# Altium schematic sheet Sheet1.SchDoc
size A4
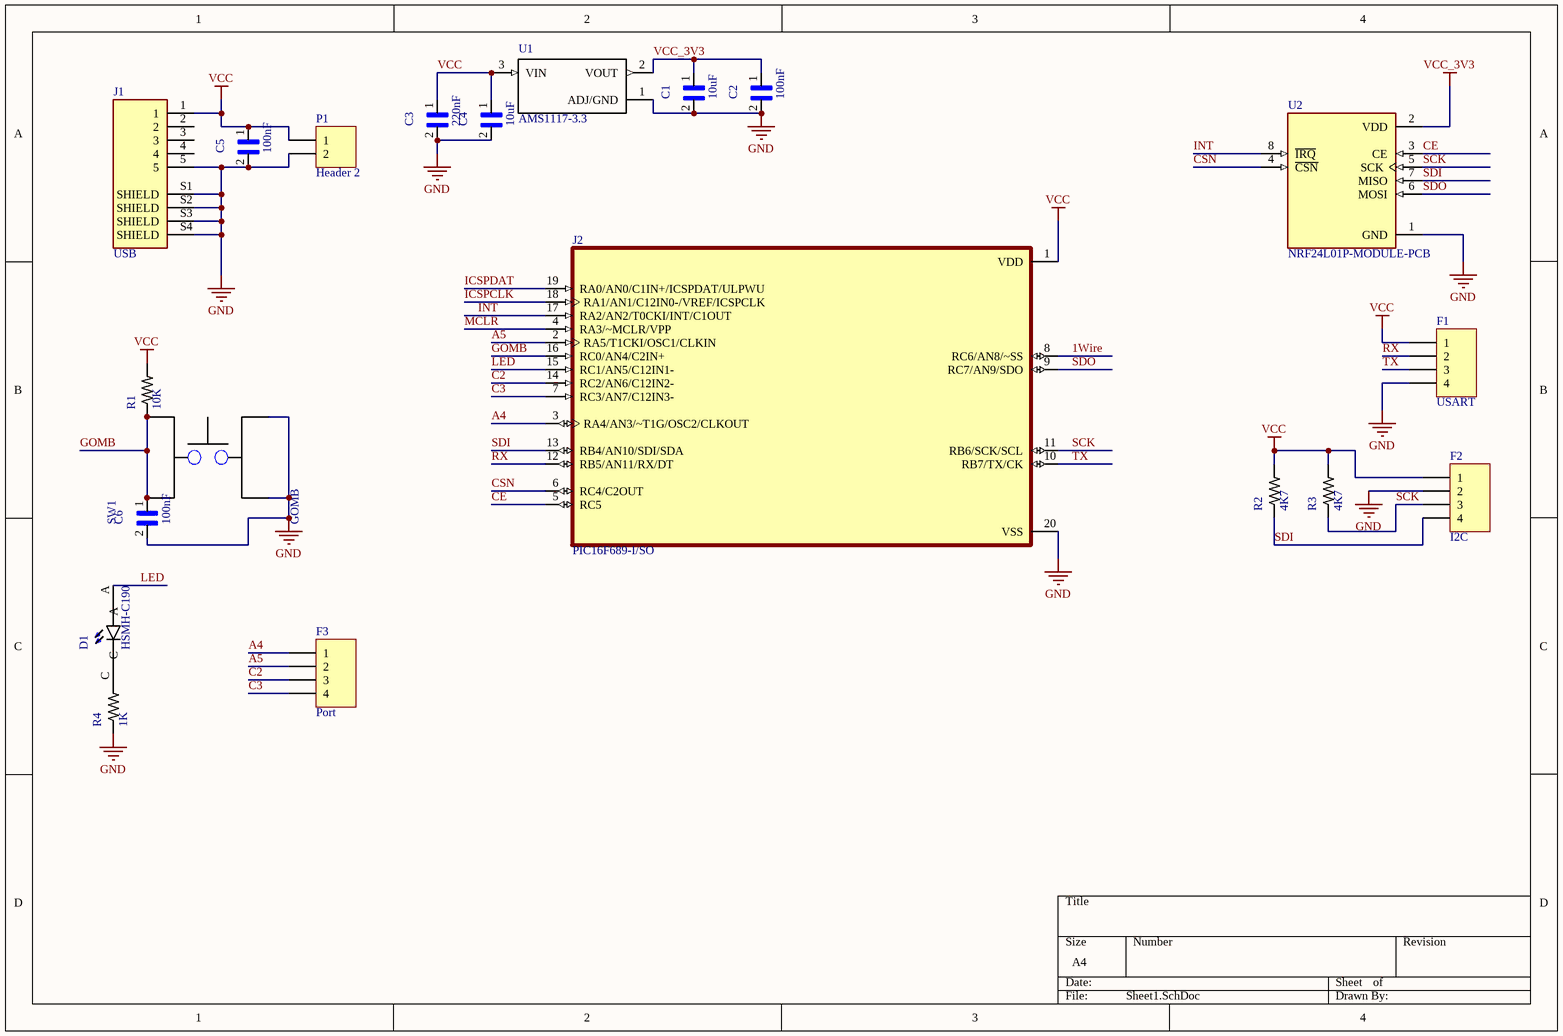
[diagram p0: Sheet1.SchDoc]

## Parts
C1  10uF  [CAP0603]
C2  100nF  [CAP0603]
C3  220nF  [CAP0603]
C4  10uF  [CAP0603]
C5  100nF  [CAP0603]
C6  100nF  [CAP0603]
D1  HSMH-C190  [LEDM1608X80_HSMH-C190(Primary)]
F1  USART  [HDR1X4]
F2  I2C  [HDR1X4]
F3  Port  [HDR1X4]
J1  USB  [WE_629105136821]
J2  PIC16F689-I/SO  [SOIC127P1032X265-20N]
P1  Header 2  [HDR1X2]
R1  10K  [RES0603]
R2  4K7  [RES0603]
R3  4K7  [RES0603]
R4  1K  [RES0603]
SW1  GOMB  [SW_TL3342F160QG/TR]
U1  AMS1117-3.3  [SOT229P700X180-4N]
U2  NRF24L01P-MODULE-PCB  [XCVR_NRF24L01P-MODULE-PCB]

## Nets
GND: C1.2 C2.2 C3.2 C4.2 C5.2 C6.2 F1.4 F2.2 J1.5 J1.S1(SHIELD) J1.S2(SHIELD) J1.S3(SHIELD) J1.S4(SHIELD) J2.20(VSS) P1.2 R4.1 SW1.1 SW1.2 U1.1(ADJ/GND) U2.1(GND)
VCC: C3.1 C4.1 C5.1 F1.1 F2.1 J1.1 J2.1(VDD) P1.1 R1.2 R2.2 R3.2 U1.3(VIN)
VCC_3V3: C1.1 C2.1 U1.2(VOUT) U2.2(VDD)
1Wire: J2.8(RC6/AN8/~SS)
A4: F3.1 J2.3(RA4/AN3/~T1G/OSC2/CLKOUT)
A5: F3.2 J2.2(RA5/T1CKI/OSC1/CLKIN)
C2: F3.3 J2.14(RC2/AN6/C12IN2-)
C3: F3.4 J2.7(RC3/AN7/C12IN3-)
CE: J2.5(RC5) U2.3(CE)
CSN: J2.6(RC4/C2OUT) U2.4(~{CSN})
GOMB: C6.1 J2.16(RC0/AN4/C2IN+) R1.1 SW1.3 SW1.4
ICSPCLK: J2.18(RA1/AN1/C12IN0-/VREF/ICSPCLK)
ICSPDAT: J2.19(RA0/AN0/C1IN+/ICSPDAT/ULPWU)
INT: J2.17(RA2/AN2/T0CKI/INT/C1OUT) U2.8(~{IRQ})
LED: D1.A J2.15(RC1/AN5/C12IN1-)
MCLR: J2.4(RA3/~MCLR/VPP)
RX: F1.2 J2.12(RB5/AN11/RX/DT)
SCK: F2.3 J2.11(RB6/SCK/SCL) R3.1 U2.5(SCK)
SDI: F2.4 J2.13(RB4/AN10/SDI/SDA) R2.1 U2.7(MISO)
SDO: J2.9(RC7/AN9/SDO) U2.6(MOSI)
TX: F1.3 J2.10(RB7/TX/CK)
NetD1_C: D1.C R4.2

Not connected (* = marked no-connect by the designer): J1 2 3 4

## Library data of the parts
C1-C6 = 0603: Cap Ceramic; MF: AVX; MP: 06031A6R0BAT4A; Price: None; SnapEDA_Link: https://www.snapeda.com/parts/06031A6R0BAT4A/AVX/view-part/?ref=snap; Availability: Unavailable; Package: 0603 AVX; Value: *
D1 = HSMH-C190: LED; SMD; 0603; red; 7.2-17mcd; 1.6x0.8mm; 170Â°; 1.8Ă·2.6V; 20mA; MF: Broadcom Limited; SnapEDA_Link: https://www.snapeda.com/parts/HSMH-C190/Broadcom%20Limited/view-part/?ref=snap; Package: 0603 Broadcom; Price: None; MP: HSMH-C190; Availability: Unavailable; Value: *
F1-F3 = Header 4: Header, 4-Pin; LatestRevisionDate: 17-Jul-2002; LatestRevisionNote: Re-released for DXP Platform.; Publisher: Altium Limited
J1 = 629105136821: USB - micro B USB 2.0 Receptacle Connector 5 Position Surface Mount, Right Angle; MF: Wurth Electronics; Package: None; Price: None; SnapEDA_Link: https://www.snapeda.com/parts/629105136821/Wurth%20Electronics%20Inc./view-part/1118247/?ref=snap; Availability: Unavailable; Value: *; MP: 629105136821
P1 = Header 2: Header, 2-Pin; LatestRevisionDate: 17-Jul-2002; LatestRevisionNote: Re-released for DXP Platform.; Publisher: Altium Limited
R1-R4 = 0603RES: MF: Panasonic; MP: EXB-34V103JV; Price: None; SnapEDA_Link: https://www.snapeda.com/parts/EXB-34V103JV/Panasonic%20Electronic%20Components/view-part/?ref=snap; Availability: Unavailable; Package: 0606 Panasonic; Value: *
SW1 = TL3342F160QG/TR: Switch Tactile Spst-No 0.05a 12v; MF: E-Switch; SnapEDA_Link: https://www.snapeda.com/parts/TL3342F160QG/TR/E-Switch/view-part/?ref=snap; Price: None; Availability: Unavailable; MP: TL3342F160QG/TR; Package: FakePackage u; Value: *
U1 = AMS1117-3.3: Sot223/Pkg 1-Amp 3.3-Volt Low Drop Out Voltage Regulatator; MF: Advanced Monolithic Systems; Price: None; SnapEDA_Link: https://www.snapeda.com/parts/AMS1117-3.3/Advanced%20Monolithic%20Systems/view-part/?ref=snap; Availability: Unavailable; MP: AMS1117-3.3; Package: None; Value: *
U2 = NRF24L01P-MODULE-PCB: - Transceiver For Use With nRF24L01+; MF: Nordic Semiconductor; Package: None; MP: NRF24L01P-MODULE-PCB; Value: *; Availability: Bad; Price: None; SnapEDA_Link: https://www.snapeda.com/parts/NRF24L01P-MODULE-PCB/Nordic%20Semiconductor%20ASA/view-part/230534/?ref=snap; Mouser-Purchase-URL: https://snapeda.com/shop?store=Mouser&id=230534
J2 = PIC16F689-I/SO: Package: None; Price: None; Value: *; MP: PIC16F689-I/SO; Availability: Unavailable